# EAGLE design Mirtle_Pico_Hotec_drv8833_pi (EAGLE 9.6.2)
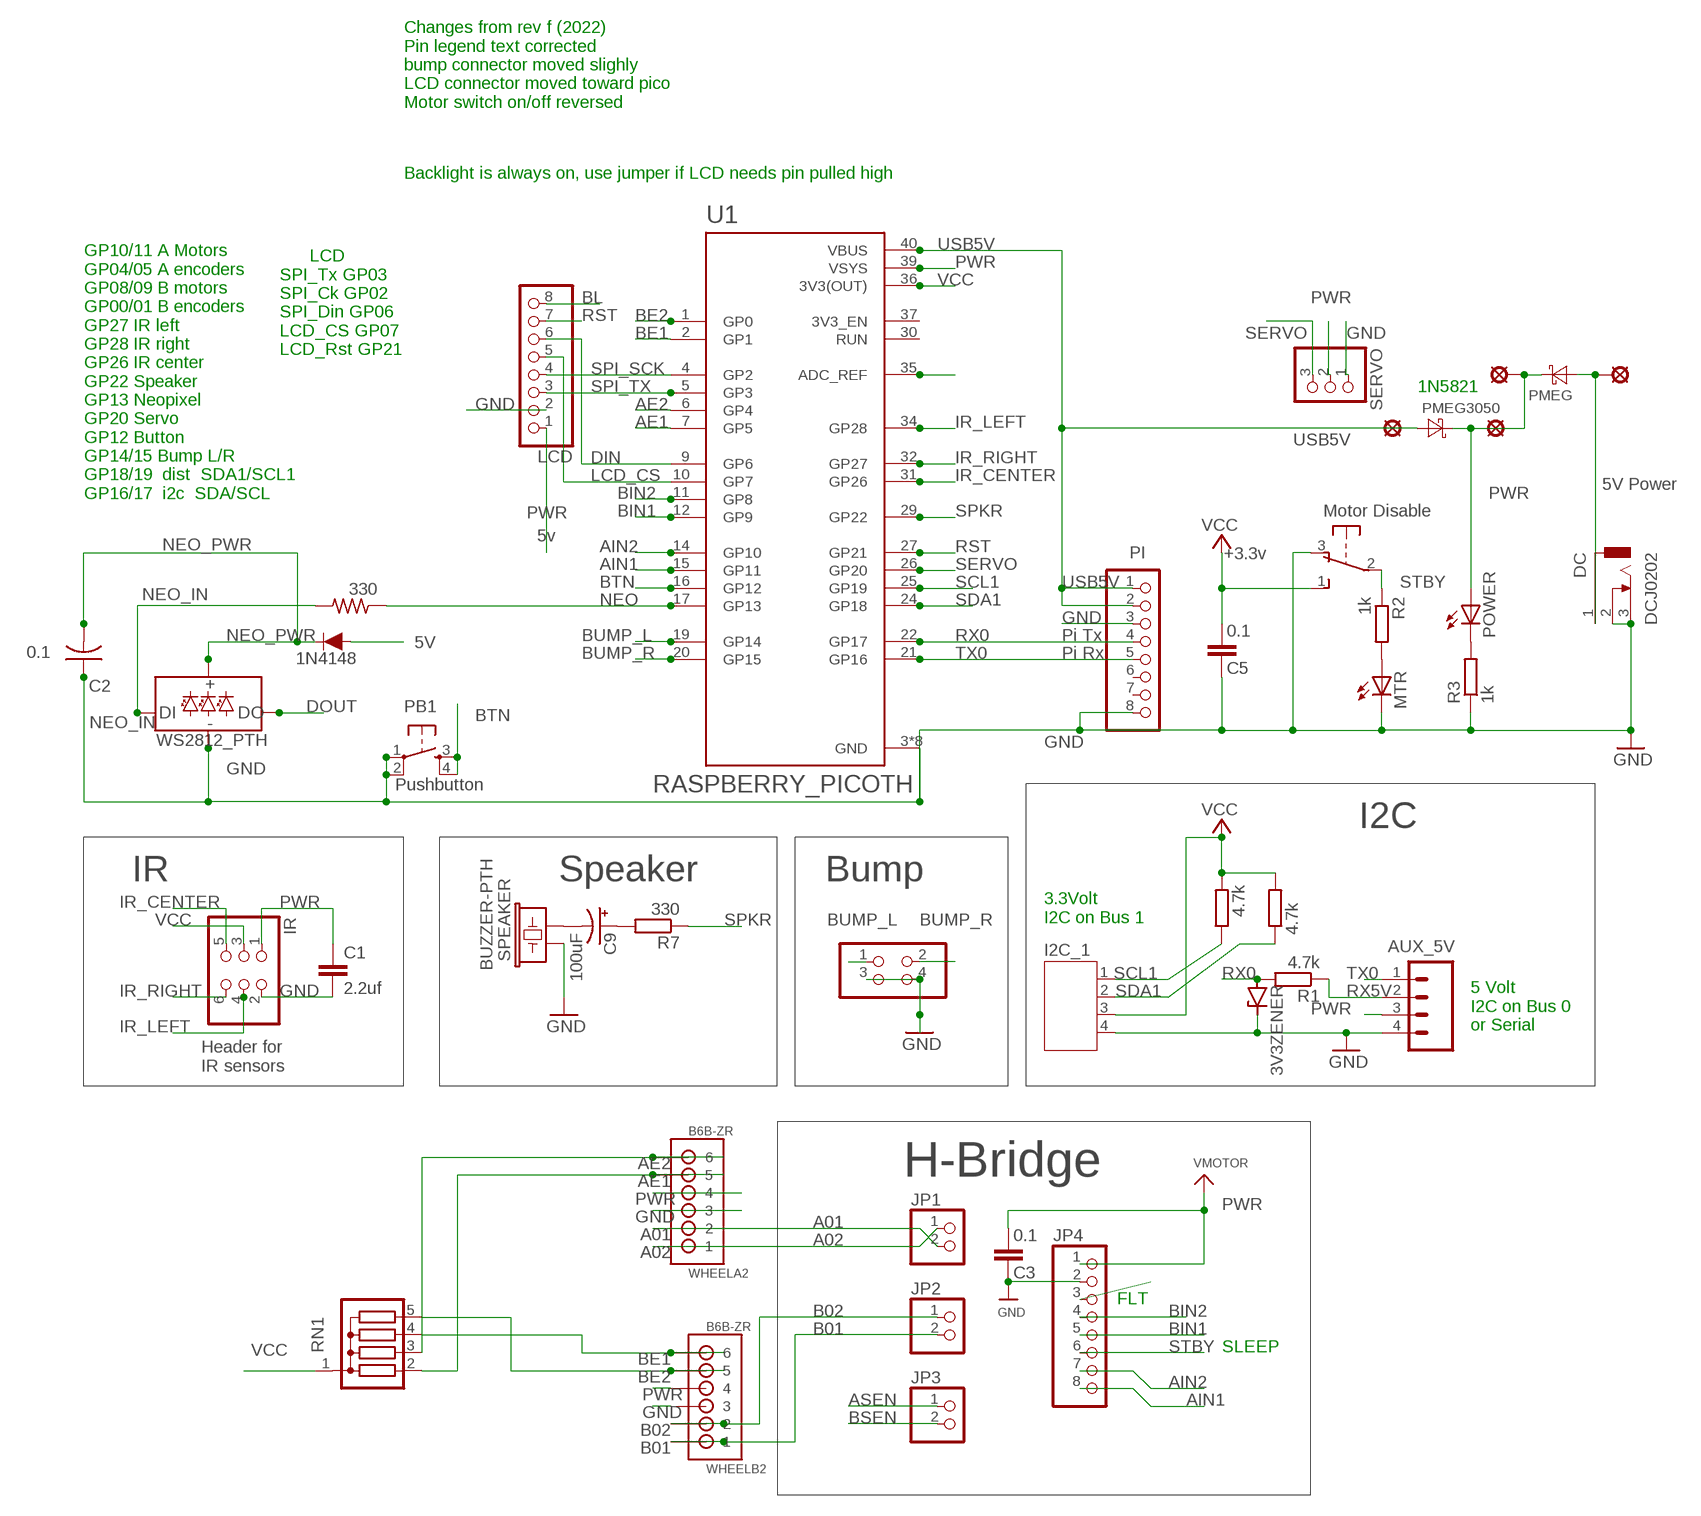
[diagram p0: schematic, sheet 1]

## Parts
3V3ZENER  ZENER-DIODEZD-5  [ZDIO-5]
AUX_5V  CONN_04  [1X04]
BUMP  PINHD-2X2  [2X02]
C1  2.2uf  C5/2.5  [C5B2.5]
C2  0.1  C-US025-024X044  [C025-024X044]
C3  0.1  CAPEZ  [CAP-PTH-SMALLEZ]
C5  0.1  CAPEZ  [CAP-PTH-SMALLEZ]
C9  100uF  CPOL-USE2.5-5  [E2,5-5]
D1  WS2812_PTH  [WS2812B-PTH-KIT]
DC  DCJ0202  [DCJ0202]
I2C_1  JST-PH4  [JST-PH4]
IN4148  200mA/100V/1V  DIODE-1N4148  [DIODE-1N4148]
IR  PINHD-2X3  [2X03]
JP1  HEADER-1X2ROUND  [1X02_ROUND]
JP2  HEADER-1X2ROUND  [1X02_ROUND]
JP3  HEADER-1X2ROUND  [1X02_ROUND]
JP4  HEADER-1X870MIL  [1X08_ROUND_70]
LCD  PINHD-1X8BIG  [1X08-BIG]
LSP1  SE14  [SE14]
LSP2  SE14  [SE14]
LSP3  SE14  [SE14]
LSP4  SE14  [SE14]
MTR  LED3MM  [LED3MM]
PB1  TAC_SWITCHPTH  [TACTILE-PTH]
PI  PINHD-1X8BIG  [1X08-BIG]
PMEG  DIODE-SCHOTTKY-SMA  [SMA]
PMEG3050  DIODE-SCHOTTKY-SMA  [SMA]
POWER  LED3MM  [LED3MM]
R1  4.7k  R-EU_0204/5  [0204/5]
R2  1k  R-EU_0204/5  [0204/5]
R3  1k  R-EU_0204/5  [0204/5]
R4  4.7k  R-EU_0204/5  [0204/5]
R5  4.7k  R-EU_0204/5  [0204/5]
R7  330  R-EU_0204/5  [0204/5]
R12  330  R-US_0204/5  [0204/5]
RN1  G04R  [SIL5]
SERVO  PINHD-1X3  [1X03]
SPEAKER  BUZZER-PTH  [BUZZER-12MM]
SW1  OS102011MA1Q  [OS102011MA1Q]
U1  RASPBERRY_PICOTH  [PICO-PKG-TH_MM]
WHEELA2  B6B-ZR  [B6B-ZR]
WHEELB2  B6B-ZR  [B6B-ZR]

## Nets
5VIN: DC.1 LSP3.MP PMEG.A
A01: JP1.2 WHEELA2.2
A02: JP1.1 WHEELA2.1
AE1: RN1.2 U1.7(GP5) WHEELA2.5
AE2: RN1.3 U1.6(GP4) WHEELA2.6
AIN1: JP4.8 U1.15(GP11)
AIN2: JP4.7 U1.14(GP10)
ASEN: JP3.1
B01: JP2.2 WHEELB2.1
B02: JP2.1 WHEELB2.2
BE1: RN1.4 U1.2(GP1) WHEELB2.6
BE2: RN1.5 U1.1(GP0) WHEELB2.5
BIN1: JP4.5 U1.12(GP9)
BIN2: JP4.4 U1.11(GP8)
BL: LCD.8
BSEN: JP3.2
BTN: PB1.3 PB1.4 U1.16(GP12)
BUMP_L: BUMP.1 U1.19(GP14)
BUMP_R: BUMP.2 U1.20(GP15)
DIN: LCD.6 U1.9(GP6)
DOUT: D1.DO
GND: 3V3ZENER.C AUX_5V.4 BUMP.3 BUMP.4 C1.2 C2.1 C3.1 C5.1 D1.GND DC.2 DC.3 I2C_1.4 IR.2 JP4.2 LCD.2 MTR.K(C) PB1.1 PB1.2 PI.3 PI.8 R3.1 SERVO.1 SPEAKER.+ SW1.3(O) U1.3(GND) U1.8(GND) U1.13(GND) U1.18(GND) U1.23(GND) U1.28(GND) U1.33(GND) U1.38(GND) WHEELA2.3 WHEELB2.3
IR_CENTER: IR.5 U1.31(GP26)
IR_LEFT: IR.4 U1.34(GP28)
IR_RIGHT: IR.6 U1.32(GP27)
LCD_CS: LCD.5 U1.10(GP7)
N$1: U1.35(ADC_REF)
N$3: POWER.K(C) R3.2
N$4: JP4.3
N$8: MTR.A R2.2
N$15: C9.- SPEAKER.-
N$16: C9.+ R7.2
NEO: R12.1 U1.17(GP13)
NEO_IN: D1.DI R12.2
NEO_PWR: C2.2 D1.VCC IN4148.C
PWR: AUX_5V.3 C1.1 C3.2 IN4148.A IR.1 JP4.1 LCD.1 LSP2.MP LSP4.MP PMEG3050.C PMEG.C POWER.A SERVO.2 U1.39(VSYS) WHEELA2.4 WHEELB2.4 ; supply symbol labelled VMOTOR
RST: LCD.7 U1.27(GP21)
RX0: 3V3ZENER.A PI.4 R1.2 U1.22(GP17)
RX5V: AUX_5V.2 R1.1
SCL1: I2C_1.1 R5.1 U1.25(GP19)
SDA1: I2C_1.2 R4.1 U1.24(GP18)
SERVO: SERVO.3 U1.26(GP20)
SPI_SCK: LCD.4 U1.4(GP2)
SPI_TX: LCD.3 U1.5(GP3)
SPKR: R7.1 U1.29(GP22)
STBY: JP4.6 R2.1 SW1.2(P)
TX0: AUX_5V.1 PI.5 U1.21(GP16)
USB5V: LSP1.MP PI.1 PI.2 PMEG3050.A U1.40(VBUS)
VCC: C5.2 I2C_1.3 IR.3 R4.2 R5.2 RN1.1 SW1.1(S) U1.36(3V3(OUT))
Unconnected: PI.6 PI.7 SW1.MT1(MT) SW1.MT2(MT) U1.30(RUN) U1.37(3V3_EN)

## Notes on the sheet
- Changes from rev f (2022)
  Pin legend text corrected
  bump connector moved slighly
  LCD connector moved toward pico
  Motor switch on/off reversed
- Backlight is always on, use jumper if LCD needs pin pulled high
- LCD
  SPI_Tx GP03
  SPI_Ck GP02
  SPI_Din GP06
  LCD_CS GP07
  LCD_Rst GP21
- 1N5821
- 5V Power
- GP10/11 A Motors
  GP04/05 A encoders
  GP08/09 B motors
  GP00/01 B encoders
  GP27 IR left
  GP28 IR right
  GP26 IR center
  GP22 Speaker
  GP13 Neopixel
  GP20 Servo
  GP12 Button
  GP14/15 Bump L/R
  GP18/19  dist  SDA1/SCL1
  GP16/17  i2c  SDA/SCL
- Motor Disable
- 5v
- +3.3v
- Pi Tx
- 5V
- Pi Rx
- 1N4148
- Pushbutton
- I2C
- IR | Speaker | Bump
- 3.3Volt
  I2C on Bus 1
- 5 Volt
  I2C on Bus 0
  or Serial
- Header for
  IR sensors
- H-Bridge
- FLT
- SLEEP

## Library data of the parts
3V3ZENER = diode:ZENER-DIODE: Z-Diode
AUX_5V = SparkFun-Connectors:CONN_04: Multi connection point. Often used as Generic Header-pin footprint for 0.1 inch spaced/style header connections On any of the 0.1 inch spaced packages, you can populate with these: Break Away Headers - Straight <https://www.sparkfun.com/products/116> (PRT-00116) Break Away Male Headers - Right Angle <https://www.sparkfun.com/products/553> (PRT-00553) Female Headers <https://www.sparkfun.com/products/115> (PRT-00115) Break Away Headers - Machine Pin <https://www.sparkfun.com/products/117> (PRT-00117) Break Away Female Headers - Swiss Machine Pin <https://www.sparkfun.com/products/743> (PRT-00743) For SCREWTERMINALS and SPRING TERMINALS visit here: Screw Terimnals on SparkFun.com <https://www.sparkfun.com/search/results?term=Screw+Terminals> (5mm/3.5mm/2.54mm spacing) This device is also useful as a general connection point to wire up your design to another part of your project. Our various solder wires solder well into these plated through hole pads. Hook-Up Wire - Assortment (Stranded, 22 AWG) <https://www.sparkfun.com/products/11375> (PRT-11375) Hook-Up Wire - Assortment (Solid Core, 22 AWG) <https://www.sparkfun.com/products/11367> (PRT-11367) View the entire wire category on our website here <https://www.sparkfun.com/categories/141> Special notes: Molex polarized connector foot print use with SKU : PRT-08231 with associated crimp pins and housings. 1MM SMD Version SKU: PRT-10208; PROD_ID: CONN-09696
BUMP = pinhead:PINHD-2X2: PIN HEADER
C1 = capacitor-wima:C: CAPACITOR naming: grid - package width
C2 = adafruit_mem:C-US: CAPACITOR, American symbol
C3 C5 = SparkFun-Passives:CAP: Capacitor Standard 0603 ceramic capacitor, and 0.1" leaded capacitor.
C9 = adafruit:CPOL-US: POLARIZED CAPACITOR, American symbol
D1 = SparkFun-LED:WS2812: Addressable RGB LED - 1 Wire Common names: WS2812, SK6812, Neopixel, APA-106, etc. SMD LED with built-in controller IC. Color: Red/Green/Blue SparkFun Products: LED-SMD RGB (WS2812) <https://www.sparkfun.com/products/11821> LED - RGB Addressable, PTH, 5mm Diffused (5 Pack) <https://www.sparkfun.com/products/12986> LED - RGB Addressable, PTH, 5mm Clear (5 Pack) <https://www.sparkfun.com/products/12999> Blynk Board - ESP8266 <https://www.sparkfun.com/products/13794> Datasheet referenced for footprint: WS2812B-PTH <https://cdn.sparkfun.com/datasheets/Components/LED/COM-12877.pdf>
DC = con-jack:DCJ0202: DC POWER JACK Source: DCJ0202.pdf; OC_FARNELL: unknown; OC_NEWARK: unknown
I2C_1 = jst-ph:JST-PH4
IN4148 = SparkFun-DiscreteSemi:DIODE: Diode These are standard reverse protection diodes and small signal diodes. SparkFun Products: SparkFun SparkPunk Sound Kit <https://www.sparkfun.com/products/11177> SparkFun ESP8266 Thing <https://www.sparkfun.com/products/13231>; PROD_ID: DIO-08378
IR = pinhead:PINHD-2X3: PIN HEADER
JP1-JP3 = microbuilder:HEADER-1X2: PIN HEADER
JP4 = microbuilder:HEADER-1X8: PIN HEADER
LCD PI = adafruit:PINHD-1X8: PIN HEADER
LSP1-LSP4 = solpad:SE14: SOLDER PAD E1553, drill 1,4mm, distributor Buerklin, 07F820
MTR POWER = led:LED: LED OSRAM: - CHIPLED LG R971, LG N971, LY N971, LG Q971, LY Q971, LO R971, LY R971 LH N974, LH R974 LS Q976, LO Q976, LY Q976 LO Q996 - Hyper CHIPLED LW Q18S LB Q993, LB Q99A, LB R99A - SideLED LS A670, LO A670, LY A670, LG A670, LP A670 LB A673, LV A673, LT A673, LW A673 LH A674 LY A675 LS A676, LA A676, LO A676, LY A676, LW A676 LS A679, LY A679, LG A679 - Hyper Micro SIDELED® LS Y876, LA Y876, LO Y876, LY Y876 LT Y87S - SmartLED LW L88C, LW L88S LB L89C, LB L89S, LG L890 LS L89K, LO L89K, LY L89K LS L896, LA L896, LO L896, LY L896 - TOPLED LS T670, LO T670, LY T670, LG T670, LP T670 LSG T670, LSP T670, LSY T670, LOP T670, LYG T670 LG T671, LOG T671, LSG T671 LB T673, LV T673, LT T673, LW T673 LH T674 LS T676, LA T676, LO T676, LY T676, LB T676, LH T676, LSB T676, LW T676 LB T67C, LV T67C, LT T67C, LS T67K, LO T67K, LY T67K, LW E67C LS E67B, LA E67B, LO E67B, LY E67B, LB E67C, LV E67C, LT E67C LW T67C LS T679, LY T679, LG T679 LS T770, LO T770, LY T770, LG T770, LP T770 LB T773, LV T773, LT T773, LW T773 LH T774 LS E675, LA E675, LY E675, LS T675 LS T776, LA T776, LO T776, LY T776, LB T776 LHGB T686 LT T68C, LB T68C - Hyper Mini TOPLED® LB M676 - Mini TOPLED Santana® LG M470 LS M47K, LO M47K, LY M47K Source: http://www.osram.convergy.de LUXEON: - LUMILED® LXK2-PW12-R00, LXK2-PW12-S00, LXK2-PW14-U00, LXK2-PW14-V00 LXK2-PM12-R00, LXK2-PM12-S00, LXK2-PM14-U00 LXK2-PE12-Q00, LXK2-PE12-R00, LXK2-PE12-S00, LXK2-PE14-T00, LXK2-PE14-U00 LXK2-PB12-K00, LXK2-PB12-L00, LXK2-PB12-M00, LXK2-PB14-N00, LXK2-PB14-P00, LXK2-PB14-Q00 LXK2-PR12-L00, LXK2-PR12-M00, LXK2-PR14-Q00, LXK2-PR14-R00 LXK2-PD12-Q00, LXK2-PD12-R00, LXK2-PD12-S00 LXK2-PH12-R00, LXK2-PH12-S00 LXK2-PL12-P00, LXK2-PL12-Q00, LXK2-PL12-R00 Source: www.luxeon.com KINGBRIGHT: KA-3528ASYC Source: www.kingbright.com
PB1 = SparkFun-Electromechanical:TAC_SWITCH: Momentary Switch Button commonly used for reset or general input. Spark Fun Electronics SKU : COM-00097 SMT- SWCH-08247
PMEG PMEG3050 = diod_barthess:DIODE-SCHOTTKY-: SCHOTTKY DIODE
R1-R5 R7 = resistor:R-EU_: RESISTOR, European symbol
R12 = rcl:R-US_: RESISTOR, American symbol; SPICEPREFIX: R
RN1 = resistor-sil:G04R: SIL RESISTOR; OC_FARNELL: unknown; OC_NEWARK: unknown
SERVO = adafruit:PINHD-1X3: PIN HEADER
SPEAKER = SparkFun-Electromechanical:BUZZER: Buzzer Small round buzzers that operate around the audible 2kHz range. You can use these as speakers to create simple music or user interfaces. Variant Overview: PTH - Mini Speaker - PC Mount 12mm 2.048kHz <https://www.sparkfun.com/products/7950> PTH_KIT - Mini Speaker - PC Mount 12mm 2.048kHz <https://www.sparkfun.com/products/7950> KIT simplifies soldering by adding stop mask to one side of the pads. PTH_NO_SILK - Mini Speaker - PC Mount 12mm 2.048kHz <https://www.sparkfun.com/products/7950> No silkscreen indicator of buzzer outline. PTH_KIT_NO_SILK - Mini Speaker - PC Mount 12mm 2.048kHz <https://www.sparkfun.com/products/7950> KIT package w/o silkscreen SMD - Buzzer Audio Magnetic (CCV-084B16) SMD buzzer used on, e.g. the LilyPad Buzzer <https://www.sparkfun.com/products/8463> and RFID USB Reader <https://www.sparkfun.com/products/9963>. SMD_KIT - Buzzer Audio Magnetic (CCV-084B16) SMD Buzzer with elongated pins to make soldering easier. Used on the SparkFun Simon Says - Surface Mount Soldering Kit <https://www.sparkfun.com/products/10935>.; PROD_ID: COMP-08253; SF_SKU: COM-07950
SW1 = adafruit_mem:OS102011MA1Q: OS10201MA1Q through-hole right angle switch http://www.ladyada.net/library/eagle
U1 = RpiPicoMM:RASPBERRY_PICO: Raspberry Pi Pico
WHEELA2 WHEELB2 = jst:B6B-ZR: JST-ZH Connector 6 pol, 1.5mm pitch Package: B6B-ZR Source: http://www.jst-mfg.com/product/pdf/eng/eZH.pdf

## Net classes
1 power: width 0.305 mm, clearance 0.305 mm

## Board
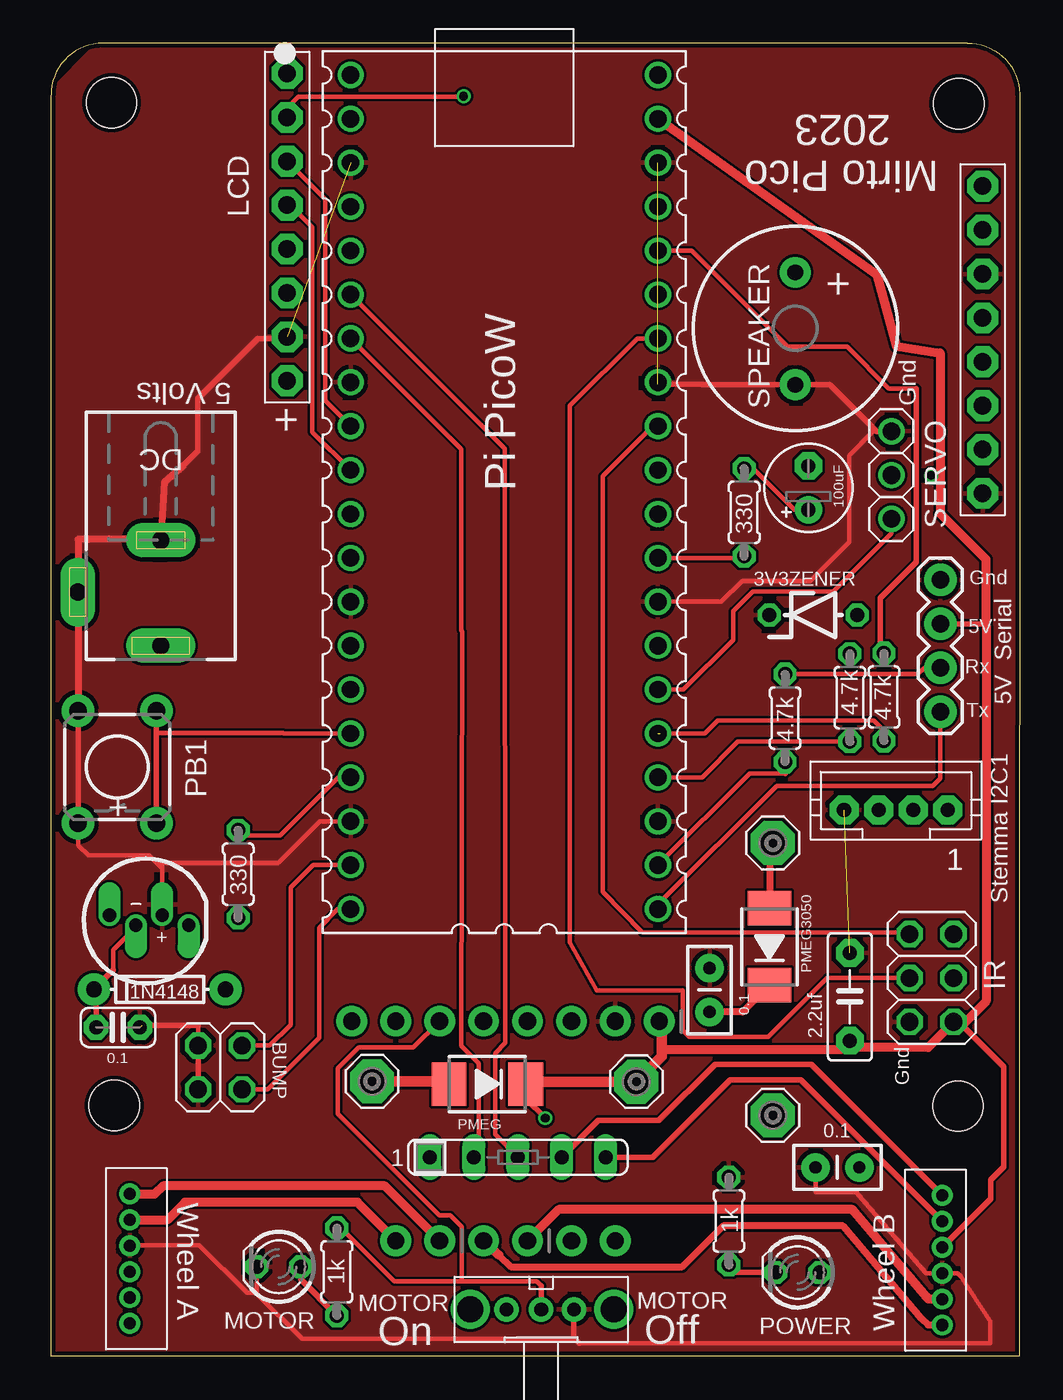
[diagram p1: board, top side]
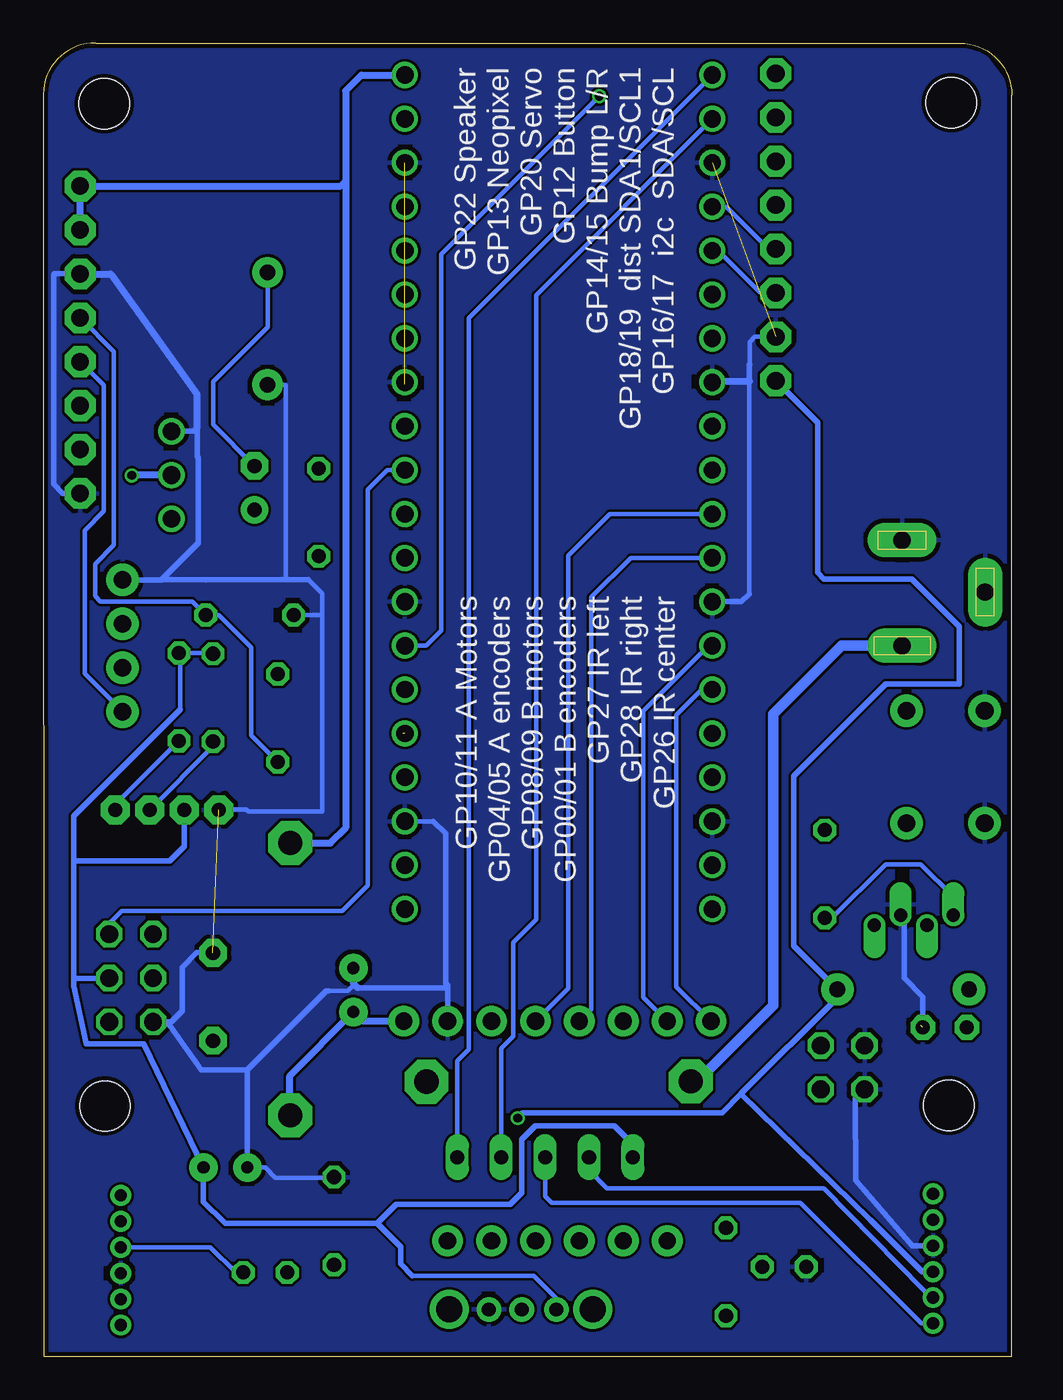
[diagram p2: board, bottom side, seen from below]

Size 56.03 x 75.98 mm. Coordinates in mm from the lower left corner, seen from the top.
Outline: 53,75.98 3,75.98 arc90 0,72.98 0,0 56.01,0 56.03,73.04 arc90 53,75.98
Copper layers (1*16): Top 0.035mm / dielectric 1.5mm / Bottom 0.035mm
Design rules "SeeedStudio_2layer_DRU_no_angle_20140221": minimum track width 6mil, minimum drill 12mil, track to track 6mil, track to pad 6mil, pad to pad 6mil, via to via 6mil, smd to smd 0mil, copper to edge 10mil, drill to drill 10mil, minimum pad ring 10mil, minimum via ring 6mil, stop-mask expansion 2mil, vias tented up to drill 100mil, thermal gap 10mil
Holes 2.9 mm at 3.5,72.53 52.51,72.48 3.66,14.53 52.46,14.48
tRestrict: area 6,27.2 to 6.8,28; area 3.8,6 to 4.6,6.8; area 48.2,53.8 to 49,54.6; area 48.2,53.8 to 49,54.6; area 48.2,53.8 to 49,54.6; area 48.3,52.4 to 49.1,53.2; area 1.1,45.6 to 1.9,46.4; area 0.3,43.8 to 1.1,44.6; area 0.4,30.4 to 1.2,31.2; area 0.4,36.9 to 1.2,37.7; area 1.9,36.9 to 2.7,37.7; area 13.2,59.3 to 14,60.1; 67 more areas
bRestrict: area 11.6,5.4 to 12.4,6.2; area 5.9,27.2 to 6.8,28; area 3.8,6 to 4.6,6.8; area 48.2,53.8 to 49,54.6; area 48.8,53.1 to 49.6,53.9; area 48.2,52.4 to 49,53.2; area 1.1,42 to 1.9,42.8; area 0.3,43.8 to 1.1,44.6; area 5.9,46 to 6.7,46.8; area 6.6,46.8 to 7.4,47.6; area 2,30.6 to 2.8,31.4; area 2,43.9 to 2.8,44.7; 73 more areas

### Footprints (pad centres in the part's own frame; a part is rotated, then mirrored left to right if it is on the bottom)
ZDIO-5 = drill 0.813 octagon: A 2.54,0; C -2.54,0
1X04 = drill 1.016 pad 1.88: 1 0,0; 2 2.54,0; 3 5.08,0; 4 7.62,0
2X02 = drill 1.016 octagon: 1 -1.27,-1.27; 2 -1.27,1.27; 3 1.27,-1.27; 4 1.27,1.27
C5B2.5 = drill 0.813 pad 1.6 octagon: 1 -2.54,0; 2 2.54,0
C025-024X044 = drill 0.813 pad 1.422 octagon: 1 -1.27,0; 2 1.27,0
CAP-PTH-SMALLEZ = drill 0.7 pad 1.651: 1 0,0; 2 2.54,0
E2,5-5 = drill 0.813 pad 1.6: + -1.27,0 | drill 0.813 pad 1.6 octagon: - 1.27,0
WS2812B-PTH-KIT = drill 0.762 pad 1.27 offset: DI 2.413,0.079; DO -2.159,0.651; GND -0.635,0.079; VCC 0.889,0.651
DCJ0202 = drill 1 pad 2 long: 1 0,3.1; 2 4.8,0; 3 0,-3
JST-PH4 = drill 0.813 pad 1.676 octagon: 1 3,0; 2 1,0; 3 -1,0; 4 -3,0
DIODE-1N4148 = drill 0.9 pad 1.88: A -3.81,0; C 3.81,0
2X03 = drill 1.016 octagon: 1 -2.54,-1.27; 2 -2.54,1.27; 3 0,-1.27; 4 0,1.27; 5 2.54,-1.27; 6 2.54,1.27
1X02_ROUND = drill 1 pad 1.778: 1 -1.27,0; 2 1.27,0
1X08_ROUND_70 = drill 1 pad 1.778: 1 -8.89,0; 2 -6.35,0; 3 -3.81,0; 4 -1.27,0; 5 1.27,0; 6 3.81,0; 7 6.35,0; 8 8.89,0
1X08-BIG = drill 1.016 pad 1.778 octagon: 1 -8.89,0; 2 -6.35,0; 3 -3.81,0; 4 -1.27,0; 5 1.27,0; 6 3.81,0; 7 6.35,0; 8 8.89,0
SE14 = drill 1.397 pad 2.54 octagon: MP 0,0
LED3MM = drill 0.813 octagon: A -1.27,0; K 1.27,0
TACTILE-PTH = drill 1.016 pad 1.88: 1 -3.251,2.261; 2 3.251,2.261; 3 -3.251,-2.261; 4 3.251,-2.261
SMA = smd 2 x 2.5: A 2.223,0; C -2.223,0
0204/5 = drill 0.813 octagon: 1 -2.54,0; 2 2.54,0
SIL5 = drill 0.813 long: 1 -5.08,0; 2 -2.54,0; 3 0,0; 4 2.54,0; 5 5.08,0
1X03 = drill 1.016: 1 -2.54,0; 2 0,0; 3 2.54,0
BUZZER-12MM = drill 0.9 pad 1.778: + 3.25,0; - -3.25,0
OS102011MA1Q = drill 0.8 pad 1.422: 1 -2,0; 2 0,0; 3 1.9,0 | drill 1.5 pad 2.184: MT1 -4.1,0; MT2 4.2,0
PICO-PKG-TH_MM = drill 1: 1 -8.89,24.13; 2 -8.89,21.59; 3 -8.89,19.05; 4 -8.89,16.51; 5 -8.89,13.97; 6 -8.89,11.43; 7 -8.89,8.89; 8 -8.89,6.35; 9 -8.89,3.81; 10 -8.89,1.27; 11 -8.89,-1.27; 12 -8.89,-3.81; 13 -8.89,-6.35; 14 -8.89,-8.89; 15 -8.89,-11.43; 16 -8.89,-13.97; 17 -8.89,-16.51; 18 -8.89,-19.05; 19 -8.89,-21.59; 20 -8.89,-24.13; 21 8.89,-24.13; 22 8.89,-21.59; 23 8.89,-19.05; 24 8.89,-16.51; 25 8.89,-13.97; 26 8.89,-11.43; 27 8.89,-8.89; 28 8.89,-6.35; 29 8.89,-3.81; 30 8.89,-1.27; 31 8.89,1.27; 32 8.89,3.81; 33 8.89,6.35; 34 8.89,8.89; 35 8.89,11.43; 36 8.89,13.97; 37 8.89,16.51; 38 8.89,19.05; 39 8.89,21.59; 40 8.89,24.13
B6B-ZR = drill 0.7: 1 9,-1.3; 2 7.5,-1.3; 3 6,-1.3; 4 4.5,-1.3; 5 3,-1.3; 6 1.5,-1.3

### Placement (x,y rotation side)
3V3ZENER  44.09,42.89 0 top
AUX_5V  51.44,37.3 90 top
BUMP  9.79,16.71 180 top
C1  46.21,20.8 90 top
C2  3.88,19.03 180 top
C3  38.09,22.46 270 top
C5  44.22,10.93 0 top
C9  43.81,50.25 90 top
D1  5.8,25.6 180 top
DC  6.35,44.22 180 top
I2C_1  48.87,31.62 0 top
IN4148  6.29,21.23 180 top
IR  50.94,21.89 90 top
JP1  21.21,6.69 180 top
JP2  26.29,6.69 180 top
JP3  31.37,6.69 0 top
JP4  26.29,19.39 180 top
LCD  13.66,65.34 90 top
LSP1  41.75,29.7 0 top
LSP2  33.86,15.89 0 top
LSP3  18.57,15.91 0 top
LSP4  41.75,13.94 0 top
MTR  13.17,5.18 180 top
PB1  3.83,34.1 90 top
PI  53.89,58.82 270 top
PMEG  25.24,15.75 180 top
PMEG3050  41.56,23.7 90 top
POWER  43.19,4.85 180 top
R1  42.46,36.93 270 top
R2  16.54,4.89 270 top
R3  39.21,7.83 270 top
R4  46.21,38.11 90 top
R5  48.18,38.15 90 top
R7  40.09,48.84 90 top
R12  10.82,27.91 270 top
RN1  27,11.52 0 top
SERVO  48.61,50.99 270 top
SPEAKER  43.05,59.47 270 top
SW1  28.35,2.71 0 top
U1  26.22,50.01 0 top
WHEELA2  3.26,0.4 90 top
WHEELB2  52.85,10.81 270 top

### Tracks (layer width: path | path; a pad name or v marks a point on that pad's centre or on a via)
5VIN
  Top 0.61: PMEG.A 23.18,15.91 LSP3.MP
  Bottom 0.61: DC.1 9.83,41.12 13.79,37.16 13.79,20.31 18.19,15.91 LSP3.MP
A01
  Top 0.508: WHEELA2.2 6.75,7.9 7.76,8.91 17.72,8.91 JP1.2
A02
  Top 0.508: JP1.1 19.32,9.85 6.48,9.85 6,9.4 WHEELA2.1
AE1
  Top 0.254: U1.7 23.73,52.5 23.73,42 23.79,41.94 23.73,17.97 24.74,16.96 24.74,11.8 RN1.2
  Bottom 0.254: RN1.2 24.46,10.76 23.42,9.72 10.88,9.72 5.13,3.84 4.69,3.4 WHEELA2.5
AE2
  Top 0.254: RN1.3 25.69,12.83 25.69,17.53 26.29,18.13 26.25,52.52 U1.6
  Bottom 0.254: RN1.3 27,9.27 26.61,8.88 12.23,8.88 5.25,1.9 WHEELA2.6
AIN1
  Bottom 0.254: JP4.8 19.4,21.39 19.4,37.12 17.94,38.58 U1.15
AIN2
  Bottom 0.254: JP4.7 21.32,20.77 21.32,37.34 17.54,41.12 U1.14
B01
  Top 0.406: 25.91,5.85 26.58,5.18 36.52,5.18 38.88,7.54 45.82,7.54 50.35,2.19 50.73,1.81 WHEELB2.1
  Top 0.508: JP2.2 25.07,6.69 25.91,5.85
B02
  Top 0.508: WHEELB2.2 50.77,3.31 50.66,3.42 46.36,8.5 29.37,8.5 JP2.1
BE1
  Top 0.305: WHEELB2.6 43.97,16.89 38.41,16.89 35.16,13.64 31.66,13.64 RN1.4
  Bottom 0.254: RN1.4 29.54,17.82 28.85,18.51 28.85,23.94 27.52,25.27 27.52,61.41 U1.2
BE2
  Top 0.305: WHEELB2.5 43.36,16 39.3,16 34.82,11.52 RN1.5
  Bottom 0.254: U1.1 31.41,60.06 31.41,17.75 32.08,17.08 RN1.5
BIN1
  Bottom 0.254: JP4.5 24.33,20.08 24.33,43.92 22.05,46.2 U1.12
BIN2
  Bottom 0.254: JP4.4 25.66,21.29 25.66,46.34 23.26,48.74 U1.11
BTN
  Top 0.254: PB1.3 6.09,36.06 13.43,36.06 13.45,36.04 U1.16
  Top 0.305: PB1.3 PB1.4
BUMP_L
  Top 0.254: BUMP.1 12.65,17.98 13.86,19.19 13.86,27.12 15.16,28.42 U1.19
BUMP_R
  Top 0.254: U1.20 16.6,25.88 15.52,24.8 15.52,18.42 12.54,15.45 BUMP.2
DIN
  Top 0.254: LCD.6 15.86,66.95 15.86,55.29 U1.9
GND  (5 unrouted)
  Top 0.254: U1.18 15.55,30.96 13.14,28.55 6.47,28.55 6.45,28.57 6.43,28.55 6.43,28.23 | MTR.K 11.9,3.68 | C5.1 44.24,10.91 44.24,9.48 46.59,9.48 50.57,4.86 50.62,4.81 WHEELB2.3 52.45,4.81 52.62,4.64 54.34,2.02 54.34,0.74 30.55,0.74 | 6.43,28.23 D1.GND | WHEELA2.3 4.59,6.43 8.59,6.43 11.34,3.68 11.9,3.68 | 11.9,3.68 11.9,3.63 14.52,1.01 27,1.01 | 30.08,1.01 30.28,1.01 | BUMP.3 8.52,19.16 | 6.43,28.23 5.69,28.97 2.17,28.97 1.57,29.57 PB1.1 | U1.28 38.76,43.66 39.97,44.87 43.91,44.87 46.16,47.12 46.16,52.13 47.56,53.53 SERVO.1
  Top 0.305: PB1.2 PB1.1 | 5.28,19.16 8.52,19.16 | 2.2,47.28 1.55,47.28 DC.2 | BUMP.4 BUMP.3 | 35.11,56.27 37.63,56.27 37.68,56.22 SPEAKER.+ 45.04,56.22 47.76,53.5 48.58,53.5 SERVO.1 | LCD.2 13.57,58.9 11.96,58.9 8.49,55.43 8.49,52.37 7.66,51.55 | 27,1.01 30.08,1.01 | SW1.3 30.25,1.04 30.28,1.01 30.55,0.74
  Top 0.406: 7.66,51.55 6.56,50.57 DC.3 6.29,47.28 2.2,47.28 1.57,47.28 PB1.2
  Bottom 0.254: 33.47,30.96 U1.23 | 15.17,57.38 15.17,58.68 14.86,58.99 LCD.2 | 15.18,56.42 15.18,44.12 | C3.1 38.09,21.47 38.41,21.15 39.51,21.15 | C5.1 43.2,10.93 42.61,10.34 39.24,10.34 R3.1 | 40.7,44.94 39.89,44.13 39.89,43 | 39.89,43 39.89,31.52 44.16,31.52 44.28,31.64 45.85,31.64 I2C_1.4 | AUX_5V.4 51.41,44.95 | SPEAKER.+ 42.15,56.22 42.12,56.19 42,56.19 42,44.94 | 46.63,44.88 46.57,44.94 | 3V3ZENER.C 40,42.89 39.89,43
  Bottom 0.305: 33.47,30.96 32.76,30.25 32.76,21.59 32.64,21.47 | D1.GND 6.24,25.33 6.24,21.89 5.14,20.8 C2.1 | U1.13 15.64,43.66 15.18,44.12 | C1.2 46.23,23.36 47.15,23.36 48,22.51 48,19.98 48.63,19.35 IR.2 48.91,19.35 48.72,19.16 46.9,16.58 44.22,16.58 | C5.1 44.22,16.58 | 44.22,16.58 39.65,21.15 39.51,21.15 | JP4.2 32.64,21.47 | 15.17,57.38 15.18,57.37 15.18,56.42 | 37.83,21.33 32.78,21.33 32.64,21.47 | BUMP.4 9.07,14.89 9.04,10.19 5.77,6.4 WHEELA2.3 | WHEELA2.3 | SERVO.1 47.32,53.53 47.12,53.73 47.12,52.06 47.06,52 47.06,47.06 49.18,44.94 | PI.8 54.89,49.93 55.42,50.46 55.42,62.6 55.38,62.64 PI.3 | AUX_5V.4 49.2,44.92 49.18,44.94 | 40.7,44.94 42,44.94 46.57,44.94 49.18,44.94
  Bottom 0.406: C3.1 38.09,21.59 37.83,21.33 | 15.18,56.42 17.28,56.42 17.28,56.41 U1.8 | PI.3 52.14,62.63 52.06,62.55 47.12,55.64 47.12,53.73
  pour Top: 0,0 0,73.21 2.54,75.75 54.61,75.75 55.88,74.48 55.88,0
  pour Bottom: 0,0 0,73.21 1.94,75.75 54.61,75.75 55.88,74.48 55.88,0
IR_CENTER
  Bottom 0.254: U1.31 36.13,51.28 37.26,50.15 37.26,27.25 38.74,25.77 51.5,25.77 52.21,25.06 IR.5
IR_LEFT
  Top 0.254: IR.4 44.9,21.89 41.49,18.48 36.92,18.48 36.55,18.85 36.55,21.17 31.56,21.17 30.02,23.94 30.02,55.02 33.9,58.9 U1.34
IR_RIGHT
  Top 0.254: IR.6 49.56,24.54 34.2,24.54 31.92,26.87 31.92,50.92 34.82,53.82 U1.32
LCD_CS
  Top 0.254: LCD.5 13.84,66.61 15.12,65.33 15.12,53.49 U1.10
N$3
  Top 0.305: POWER.K 39.65,4.85 R3.2
N$8
  Top 0.305: R2.2 14.44,4.45 MTR.A
N$15
  Bottom 0.254: SPEAKER.- 43.05,59.54 46.2,56.39 46.2,53.91 C9.-
N$16
  Top 0.254: R7.2 40.62,51.38 43.02,48.98 C9.+
NEO
  Top 0.254: R12.1 11.13,30.14 13.26,30.14 16.62,33.5 U1.17
NEO_IN
  Bottom 0.254: D1.DI 3.39,26.6 5.26,28.47 7.31,28.47 10.41,25.36 R12.2
NEO_PWR
  Top 0.254: D1.VCC 4.72,24.76 4.72,24.65 3.6,23.53 3.6,22.35
  Top 0.305: 3.6,22.35 IN4148.C 2.61,21.1 C2.2
PWR  (via drill 0.5)
  Top 0.254: 54,42.38 54.09,42.29
  Top 0.305: PMEG.C 27.46,14.91 v28.59,13.79 | 46.6,17.87 C1.1 45.7,17.75 | WHEELB2.4 54.36,9.12 54.36,10.2 55.12,10.96 55.12,16.74 52.51,19.35 IR.1 52.9,19.35 | AUX_5V.3 54,42.38
  Top 0.406: PMEG3050.C 40,19.92 C3.2 | v50.91,50.97 51.43,51
  Top 0.508: IR.1 50.73,17.87 46.6,17.87 | 35.33,17.75 45.7,17.75 | 52.9,19.35 54.09,20.54 54.09,42.29 54.09,46.11 51.43,48.77 51.43,51 51.43,58.05 48.9,58.44 47.77,62.6 U1.39
  Top 0.61: PMEG.C 27.6,15.89 LSP2.MP 35.33,17.36 35.33,17.75 35.33,19.24 JP4.1
  Bottom 0.254: POWER.A 44.9,4.85 46.36,6.31 WHEELB2.4
  Bottom 0.305: WHEELA2.4 5.18,4.9 8.19,7.91 15.68,15.17 | 15.68,15.17 16.76,14.09 28.28,14.09 v28.59,13.79 | 15.68,15.17 10.1,20.75 IN4148.A 12.63,23.76 12.63,33.59 7.31,38.91 3.04,38.91 3.04,42.22 5.79,44.97 10.87,44.97 11.24,45.34 11.24,54.03 LCD.1
  Bottom 0.406: JP4.1 35.21,19.42 37.59,19.42 C3.2 | C3.2 | LSP4.MP 41.77,16.23 C3.2 | SERVO.2 51,51 v50.91,50.97
RST  (via drill 0.5)
  Top 0.254: v23.87,72.91 23.83,72.87 14.3,72.87 13.66,72.23 LCD.7
  Bottom 0.254: U1.27 33.88,41.12 33,42 33,63.78 v23.87,72.91
RX0
  Top 0.254: 42.48,33.73 40.42,33.73 U1.22
  Top 0.305: R1.2 42.46,33.75 42.48,33.73
  Bottom 0.254: R1.2 44,35.93 44,41 45.89,42.89 3V3ZENER.A 47.42,43.68 52.72,43.68 53.03,43.99 53.03,45.85 51.94,46.94 51.94,58.14 PI.4
RX5V
  Top 0.254: R1.1 50.13,39.47 50.5,39.84 AUX_5V.2
SCL1  (1 unrouted)
  Top 0.254: 35.24,36.04 35.25,36.05 | U1.25 37.81,36.04 38.56,36.79 47.59,36.79 48.18,36.2 R5.1
  Bottom 0.254: R5.1 51.87,31.92 I2C_1.1
SDA1
  Top 0.254: U1.24 37.66,33.5 39.73,35.57 R4.1
  Bottom 0.254: I2C_1.2 46.21,35.28 R4.1
SERVO
  Top 0.254: U1.26 36.58,38.58 39.45,41.45 39.45,43.11 40.58,44.24 45.24,44.24 48.61,47.61 SERVO.3
SPI_SCK
  Bottom 0.254: LCD.4 14.07,64.07 16.52,66.52 U1.4
SPI_TX
  Bottom 0.254: U1.5 16.98,63.98 14.55,61.55 13.73,61.55 13.71,61.53 LCD.3
SPKR
  Top 0.254: R7.1 40,46.2 U1.29
STBY
  Top 0.254: R2.1 16.64,7.54 19.85,4.33 23.86,4.33 23.86,4.34 | 23.86,4.34 23.77,4.34 23.77,7.48 23.09,8.16 22.47,8.16 16.59,14.04 16.59,16.66 17.8,17.87 20.96,17.87 JP4.6 | 23.86,4.34 28.09,4.34 28.35,4.08
  Top 0.305: 28.35,4.08 SW1.2
TX0
  Top 0.254: U1.21 35.11,26.14 41.97,33 51,33 51.44,33.44 AUX_5V.1
  Bottom 0.254: PI.5 52.53,56.19 52.53,48.9 53.64,47.79 53.64,39.5 AUX_5V.1
USB5V
  Top 0.406: 41.57,28.94 41.57,25.93 PMEG3050.A
  Top 0.61: LSP1.MP 41.75,29.12 41.57,28.94
  Bottom 0.406: 38.54,68 38.54,73.22 37.62,74.14 U1.40 | 38.54,68 38.54,30.58 39.42,29.7 LSP1.MP | PI.2 PI.1 38.83,67.71 38.54,68
VCC
  Top 0.254: U1.36 37.05,63.98 42.62,58.41 46.05,58.41 48.46,56 50.04,56
  Top 0.305: 50.04,56 50.04,45.96 47.96,43.88 47.96,40.91 R5.2
  Bottom 0.254: IR.3 52.23,21.87 | 45.57,7.76 45.5,7.69 | SW1.1 26.35,3.35 27.67,4.67 34.67,4.67 | R4.2 46.25,40.69 R5.2 48.12,40.62 48.12,37.41
  Bottom 0.305: 54.26,21.87 52.23,21.87 | 45.57,7.76 46.76,8.95 C5.2 50.22,18.08 53.55,18.08 54.26,21.43 54.26,21.87 | 34.67,4.67 35.35,5.35 35.35,6.33 36.71,7.69 | 45.5,7.69 36.71,7.69 | RN1.1 21.92,12.26 23,13.34 27.56,13.34 28.34,12.56 28.34,9.46 29.01,8.79 35.61,8.79 36.71,7.69 | 54.26,21.87 54.26,28.66 | 54.26,28.66 54.26,31.27 48.12,37.41 | I2C_1.3 47.87,29.49 48.7,28.66 54.26,28.66

### Text on the board
tPlace: Mirto Pico / 2023 | + | 5 Volts | + | Pi PicoW | Gnd | 5V | Rx | 5V Serial | Tx | Stemma I2C1 | IR | Gnd | Wheel A | MOTOR | MOTOR | MOTOR | On | Off | Wheel B
bPlace: GP22 Speaker / GP13 Neopixel / GP20 Servo / GP12 Button / GP14/15 Bump L/R / GP18/19 dist SDA1/SCL1 / GP16/17 i2c SDA/SCL | GP10/11 A Motors / GP04/05 A encoders / GP08/09 B motors / GP00/01 B encoders / GP27 IR left / GP28 IR right / GP26 IR center
tNames: Gnd | + | 1N4148